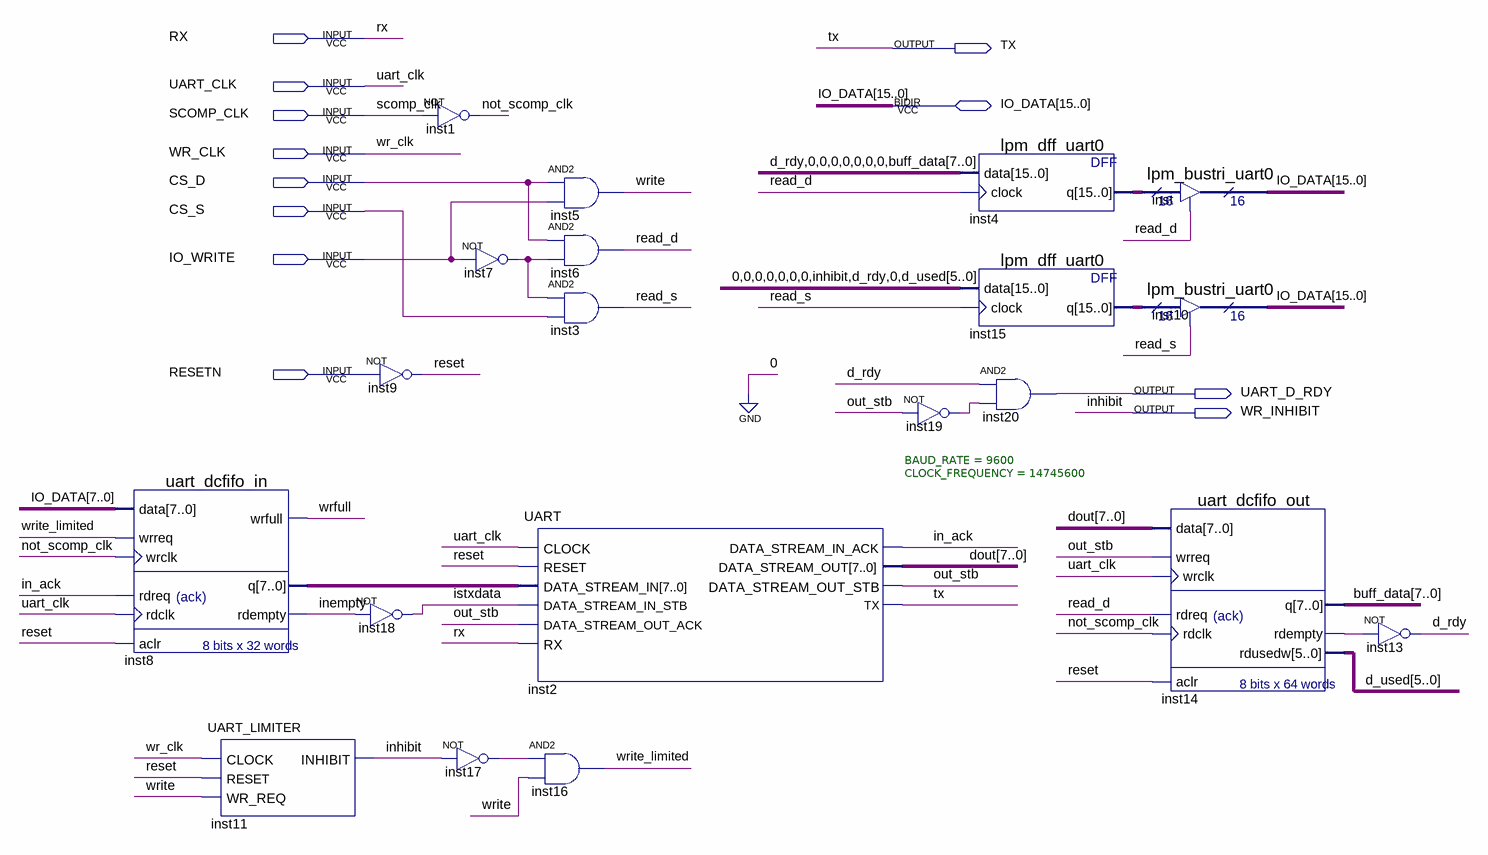
[diagram p0: schematic sheet]
// Quartus schematic UART_INTERFACE.bdf as structural Verilog: 20 symbols, 12 pins
module UART_INTERFACE (
  input  RX,
  input  UART_CLK,
  input  SCOMP_CLK,
  input  WR_CLK,
  input  CS_D,
  input  CS_S,
  input  IO_WRITE,
  input  RESETN,
  inout  [15:0] IO_DATA,
  output TX,
  output UART_D_RDY,
  output WR_INHIBIT
);

  wire d_rdy, in_ack, inempty, inst7_out, inst14_rdempty, inst17_out, inst19_out, istxdata, not_scomp_clk,
       out_stb, read_d, read_s, reset, wrfull, write, write_limited;
  wire [5:0] d_used;
  wire [7:0] buff_data, dout, inst8_q;
  wire [15:0] inst4_q, inst15_q;

  uart_dcfifo_in inst8 (
    .data(IO_DATA[7:0]), .wrreq(write_limited), .wrclk(not_scomp_clk), .rdreq(in_ack), .rdclk(UART_CLK),
    .aclr(reset), .wrfull(wrfull), .q(inst8_q), .rdempty(inempty));
  UART_LIMITER inst11 (.CLOCK(WR_CLK), .RESET(reset), .WR_REQ(write), .INHIBIT(WR_INHIBIT));
  not inst9 (reset, RESETN);
  not inst18 (istxdata, inempty);
  not inst1 (not_scomp_clk, SCOMP_CLK);
  not inst7 (inst7_out, IO_WRITE);
  not inst17 (inst17_out, WR_INHIBIT);
  and inst5 (write, CS_D, IO_WRITE);
  and inst6 (read_d, CS_D, inst7_out);
  and inst3 (read_s, inst7_out, CS_S);
  UART #(.BAUD_RATE(9600), .CLOCK_FREQUENCY(14745600)) inst2 (
    .CLOCK(UART_CLK), .RESET(reset), .DATA_STREAM_IN(inst8_q), .DATA_STREAM_IN_STB(istxdata),
    .DATA_STREAM_OUT_ACK(out_stb), .RX(RX), .DATA_STREAM_IN_ACK(in_ack), .DATA_STREAM_OUT(dout),
    .DATA_STREAM_OUT_STB(out_stb), .TX(TX));
  and inst16 (write_limited, inst17_out, write);
  not inst19 (inst19_out, out_stb);
  lpm_dff_uart0 inst4 (.data({d_rdy, {7{1'b0}}, buff_data}), .clock(read_d), .q(inst4_q));
  lpm_dff_uart0 inst15 (.data({{7{1'b0}}, WR_INHIBIT, d_rdy, 1'b0, d_used}), .clock(read_s), .q(inst15_q));
  and inst20 (UART_D_RDY, d_rdy, inst19_out);
  lpm_bustri_uart0 inst (.enabledt(read_d), .data(inst4_q), .tridata(IO_DATA));
  lpm_bustri_uart0 inst10 (.enabledt(read_s), .data(inst15_q), .tridata(IO_DATA));
  uart_dcfifo_out inst14 (
    .data(dout), .wrreq(out_stb), .wrclk(UART_CLK), .rdreq(read_d), .rdclk(not_scomp_clk), .aclr(reset),
    .q(buff_data), .rdempty(inst14_rdempty), .rdusedw(d_used));
  not inst13 (d_rdy, inst14_rdempty);

  // Other names for the same wires on the sheet: inhibit = WR_INHIBIT
endmodule
